# Altium schematic sheet Sheet2.SchDoc
size A3
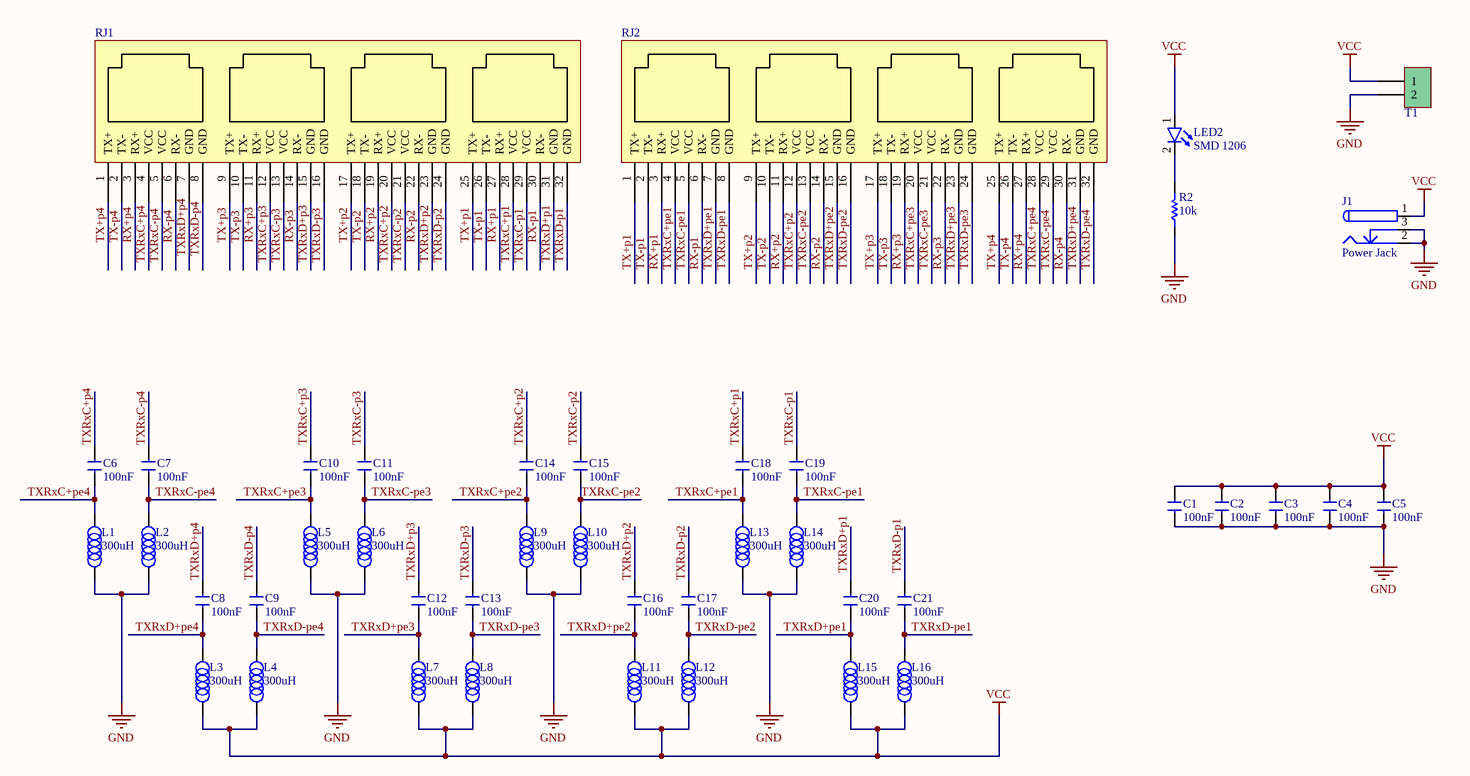
[diagram p0: Sheet2.SchDoc]

## Parts
C1  Capacitor SMD  [1206 Capacitor]  (value not drawn)
C2  Capacitor SMD  [1206 Capacitor]  (value not drawn)
C3  Capacitor SMD  [1206 Capacitor]  (value not drawn)
C4  Capacitor SMD  [1206 Capacitor]  (value not drawn)
C5  Capacitor SMD  [1206 Capacitor]  (value not drawn)
C6  Capacitor SMD  [1206 Capacitor]  (value not drawn)
C7  Capacitor SMD  [1206 Capacitor]  (value not drawn)
C8  Capacitor SMD  [1206 Capacitor]  (value not drawn)
C9  Capacitor SMD  [1206 Capacitor]  (value not drawn)
C10  Capacitor SMD  [1206 Capacitor]  (value not drawn)
C11  Capacitor SMD  [1206 Capacitor]  (value not drawn)
C12  Capacitor SMD  [1206 Capacitor]  (value not drawn)
C13  Capacitor SMD  [1206 Capacitor]  (value not drawn)
C14  Capacitor SMD  [1206 Capacitor]  (value not drawn)
C15  Capacitor SMD  [1206 Capacitor]  (value not drawn)
C16  Capacitor SMD  [1206 Capacitor]  (value not drawn)
C17  Capacitor SMD  [1206 Capacitor]  (value not drawn)
C18  Capacitor SMD  [1206 Capacitor]  (value not drawn)
C19  Capacitor SMD  [1206 Capacitor]  (value not drawn)
C20  Capacitor SMD  [1206 Capacitor]  (value not drawn)
C21  Capacitor SMD  [1206 Capacitor]  (value not drawn)
J1  Power Jack  [Power Jack]
L1  300uH  [inductor]
L2  300uH  [inductor]
L3  300uH  [inductor]
L4  300uH  [inductor]
L5  300uH  [inductor]
L6  300uH  [inductor]
L7  300uH  [inductor]
L8  300uH  [inductor]
L9  300uH  [inductor]
L10  300uH  [inductor]
L11  300uH  [inductor]
L12  300uH  [inductor]
L13  300uH  [inductor]
L14  300uH  [inductor]
L15  300uH  [inductor]
L16  300uH  [inductor]
LED2  Size: SMD 1206  [LED-5mm]  (hidden comment: Red)
R2  10k  [RES 1206 (3216X08L)]
RJ1  (no value)  [rj45-w57-4]
RJ2  (no value)  [rj45-w57-4]
T1  Phoenix terminal  [phoenix terminal 2]  (value not drawn)

## Nets
GND: C1.1 C2.1 C3.1 C4.1 C5.1 J1.2 J1.3 L1.1 L2.1 L5.1 L6.1 L9.1 L10.1 L13.1 L14.1 R2.1 T1.2
VCC: C1.2 C2.2 C3.2 C4.2 C5.2 J1.1 L3.1 L4.1 L7.1 L8.1 L11.1 L12.1 L15.1 L16.1 LED2.1(A) T1.1
RX+p1: RJ1.27(RX+) RJ2.3(RX+)
RX+p2: RJ1.19(RX+) RJ2.11(RX+)
RX+p3: RJ1.11(RX+) RJ2.19(RX+)
RX+p4: RJ1.3(RX+) RJ2.27(RX+)
RX-p1: RJ1.30(RX-) RJ2.6(RX-)
RX-p2: RJ1.22(RX-) RJ2.14(RX-)
RX-p3: RJ1.14(RX-) RJ2.22(RX-)
RX-p4: RJ1.6(RX-) RJ2.30(RX-)
TX+p1: RJ1.25(TX+) RJ2.1(TX+)
TX+p2: RJ1.17(TX+) RJ2.9(TX+)
TX+p3: RJ1.9(TX+) RJ2.17(TX+)
TX+p4: RJ1.1(TX+) RJ2.25(TX+)
TX-p1: RJ1.26(TX-) RJ2.2(TX-)
TX-p2: RJ1.18(TX-) RJ2.10(TX-)
TX-p3: RJ1.10(TX-) RJ2.18(TX-)
TX-p4: RJ1.2(TX-) RJ2.26(TX-)
TXRxC+p1: C18.2 RJ1.28(VCC)
TXRxC+p2: C14.2 RJ1.20(VCC) RJ2.12(VCC)
TXRxC+p3: C10.2 RJ1.12(VCC)
TXRxC+p4: C6.2 RJ1.4(VCC)
TXRxC+pe1: C18.1 L13.2 RJ2.4(VCC)
TXRxC+pe2: C14.1 L9.2
TXRxC+pe3: C10.1 L5.2 RJ2.20(VCC)
TXRxC+pe4: C6.1 L1.2 RJ2.28(VCC)
TXRxC-p1: C19.2 RJ1.29(VCC)
TXRxC-p2: C15.2 RJ1.21(VCC)
TXRxC-p3: C11.2 RJ1.13(VCC)
TXRxC-p4: C7.2 RJ1.5(VCC)
TXRxC-pe1: C19.1 L14.2 RJ2.5(VCC)
TXRxC-pe2: C15.1 L10.2 RJ2.13(VCC)
TXRxC-pe3: C11.1 L6.2 RJ2.21(VCC)
TXRxC-pe4: C7.1 L2.2 RJ2.29(VCC)
TXRxD+p1: C20.2 RJ1.31(GND)
TXRxD+p2: C16.2 RJ1.23(GND)
TXRxD+p3: C12.2 RJ1.15(GND)
TXRxD+p4: C8.2 RJ1.7(GND)
TXRxD+pe1: C20.1 L15.2 RJ2.7(GND)
TXRxD+pe2: C16.1 L11.2 RJ2.15(GND)
TXRxD+pe3: C12.1 L7.2 RJ2.23(GND)
TXRxD+pe4: C8.1 L3.2 RJ2.31(GND)
TXRxD-p1: C21.2 RJ1.32(GND)
TXRxD-p2: C17.2 RJ1.24(GND)
TXRxD-p3: C13.2 RJ1.16(GND)
TXRxD-p4: C9.2 RJ1.8(GND)
TXRxD-pe1: C21.1 L16.2 RJ2.8(GND)
TXRxD-pe2: C17.1 L12.2 RJ2.16(GND)
TXRxD-pe3: C13.1 L8.2 RJ2.24(GND)
TXRxD-pe4: C9.1 L4.2 RJ2.32(GND)
NetLED2_2: LED2.2(K) R2.2

## Notes on the sheet
- (in symbol Capacitor SMD) 100nF

## Library data of the parts
J1 = Power Jack: Designer: Saeid Jorablo; Company: Personal; Project Name: Laser; Adding Date: 10/21/2009
L1-L16 = Inductor SMT
LED2 = LED: Designer: Saeid Jorablo; Organazation: ControTec; Adding Date: 1387/12/22; Color: Red
R2 = Resistor: Tolerance: 5%; Power: 1/8 W; Value: 10k
RJ1 RJ2 = RJ45-w57-4
T1 = Phoenix terminal 2: Terminal 2 Pin; Designer: Seyed Mohsen Ghasemain; E-mail: picpars@gmail.com; ComponentLinkURL: www.picpars.com